# EAGLE design WW-12-fixture (EAGLE 6.5.0)
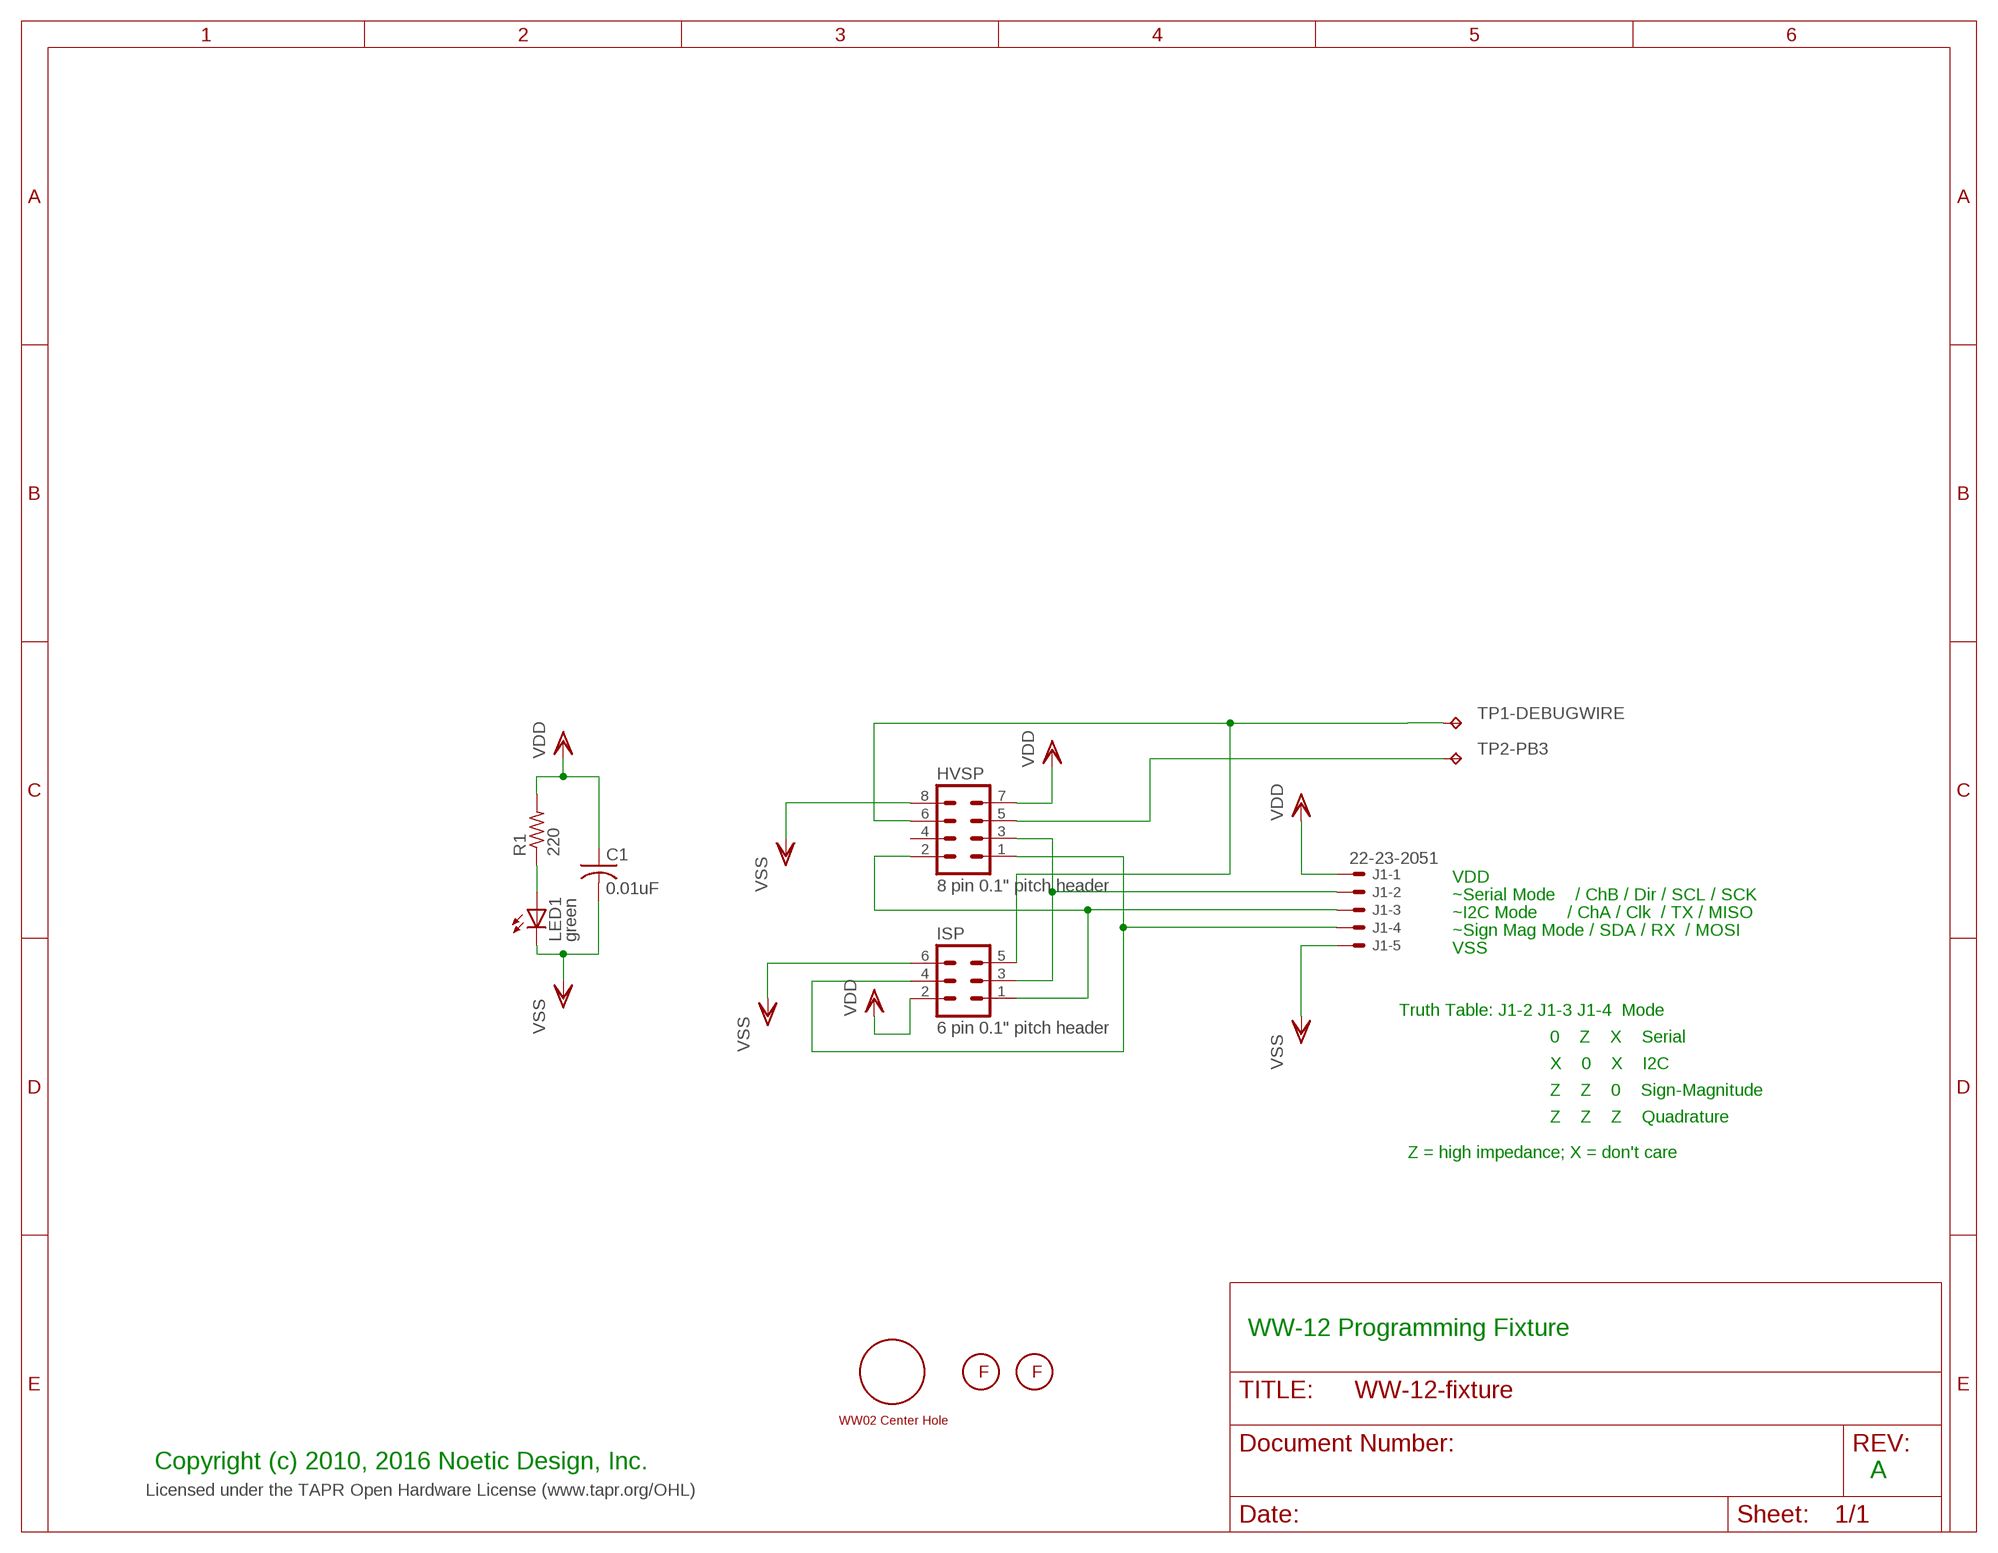
[diagram p0: schematic, sheet 1]

## Parts
C1  0.01uF  C-USC0603  [C0603]
FM1  FIDUCIAL2MMCIRCLE  [FIDUCIAL_2MMCIRCLE]
FM2  FIDUCIAL2MMCIRCLE  [FIDUCIAL_2MMCIRCLE]
HVSP  8 pin 0.1" pitch header  MA04-2  [MA04-2]
ISP  6 pin 0.1" pitch header  MA03-2  [MA03-2]
J1  22-23-2051  [22-23-2051]
LED1  green  LEDCHIP-LED0603  [CHIP-LED0603]
R1  220  R-US_R0603  [R0603]
TP1-DEBUGWIRE  DEBUG WIRE  TPB1,27  [B1,27]
TP2-PB3  DEBUG WIRE  TPB1,27  [B1,27]
U$1  WW02-CENTER  [WW02-CENTER]

## Nets
N$10: LED1.A R1.1
PB0: HVSP.1 ISP.4 J1.4
PB1: HVSP.2 ISP.1 J1.3
PB2: HVSP.3 ISP.3 J1.2
TP1: HVSP.6 ISP.5 TP1-DEBUGWIRE.TP
TP2: HVSP.5 TP2-PB3.TP
VDD: C1.1 HVSP.7 ISP.2 J1.1 R1.2
VSS: C1.2 HVSP.8 ISP.6 J1.5 LED1.C
Unconnected: HVSP.4

## Notes on the sheet
- VDD
- ~Serial Mode    / ChB / Dir / SCL / SCK
- ~I2C Mode      / ChA / Clk  / TX / MISO
- ~Sign Mag Mode / SDA / RX  / MOSI
- VSS
- Truth Table: J1-2 J1-3 J1-4  Mode
- 0    Z    X    Serial
- X    0    X    I2C
- Z    Z    0    Sign-Magnitude
- Z    Z    Z    Quadrature
- Z = high impedance; X = don't care
- WW-12 Programming Fixture
- Copyright (c) 2010, 2016 Noetic Design, Inc.
- A
- Licensed under the TAPR Open Hardware License (www.tapr.org/OHL)

## Library data of the parts
C1 = rcl:C-US: CAPACITOR, American symbol
FM1 FM2 = pickplace:FIDUCIAL: Fiducial marks
HVSP = con-lstb:MA04-2: PIN HEADER
ISP = con-lstb:MA03-2: PIN HEADER
J1 = con-molex:22-23-2051: .100" (2.54mm) Center Header - 5 Pin
LED1 = led:LED: LED OSRAM: - CHIPLED LG R971, LG N971, LY N971, LG Q971, LY Q971, LO R971, LY R971 LH N974, LH R974 LS Q976, LO Q976, LY Q976 LO Q996 - Hyper CHIPLED LW Q18S LB Q993, LB Q99A, LB R99A - SideLED LS A670, LO A670, LY A670, LG A670, LP A670 LB A673, LV A673, LT A673, LW A673 LH A674 LY A675 LS A676, LA A676, LO A676, LY A676, LW A676 LS A679, LY A679, LG A679 - Hyper Micro SIDELED® LS Y876, LA Y876, LO Y876, LY Y876 LT Y87S - SmartLED LW L88C, LW L88S LB L89C, LB L89S, LG L890 LS L89K, LO L89K, LY L89K LS L896, LA L896, LO L896, LY L896 - TOPLED LS T670, LO T670, LY T670, LG T670, LP T670 LSG T670, LSP T670, LSY T670, LOP T670, LYG T670 LG T671, LOG T671, LSG T671 LB T673, LV T673, LT T673, LW T673 LH T674 LS T676, LA T676, LO T676, LY T676, LB T676, LH T676, LSB T676, LW T676 LB T67C, LV T67C, LT T67C, LS T67K, LO T67K, LY T67K, LW E67C LS E67B, LA E67B, LO E67B, LY E67B, LB E67C, LV E67C, LT E67C LW T67C LS T679, LY T679, LG T679 LS T770, LO T770, LY T770, LG T770, LP T770 LB T773, LV T773, LT T773, LW T773 LH T774 LS E675, LA E675, LY E675, LS T675 LS T776, LA T776, LO T776, LY T776, LB T776 LHGB T686 LT T68C, LB T68C - Hyper Mini TOPLED® LB M676 - Mini TOPLED Santana® LG M470 LS M47K, LO M47K, LY M47K Source: http://www.osram.convergy.de LUXEON: - LUMILED® LXK2-PW12-R00, LXK2-PW12-S00, LXK2-PW14-U00, LXK2-PW14-V00 LXK2-PM12-R00, LXK2-PM12-S00, LXK2-PM14-U00 LXK2-PE12-Q00, LXK2-PE12-R00, LXK2-PE12-S00, LXK2-PE14-T00, LXK2-PE14-U00 LXK2-PB12-K00, LXK2-PB12-L00, LXK2-PB12-M00, LXK2-PB14-N00, LXK2-PB14-P00, LXK2-PB14-Q00 LXK2-PR12-L00, LXK2-PR12-M00, LXK2-PR14-Q00, LXK2-PR14-R00 LXK2-PD12-Q00, LXK2-PD12-R00, LXK2-PD12-S00 LXK2-PH12-R00, LXK2-PH12-S00 LXK2-PL12-P00, LXK2-PL12-Q00, LXK2-PL12-R00 Source: www.luxeon.com KINGBRIGHT: KA-3528ASYC Source: www.kingbright.com
R1 = rcl:R-US_: RESISTOR, American symbol
TP1-DEBUGWIRE TP2-PB3 = testpad:TP: Test pad
U$1 = noetic:WW02-CENTER: WW-02/WW-12 center hole

## Net classes
0 default: width 0.203 mm, drill 0.203 mm, clearance 0.229 mm
1 power: width 0.61 mm, drill 0.61 mm, clearance 0.254 mm

## Board
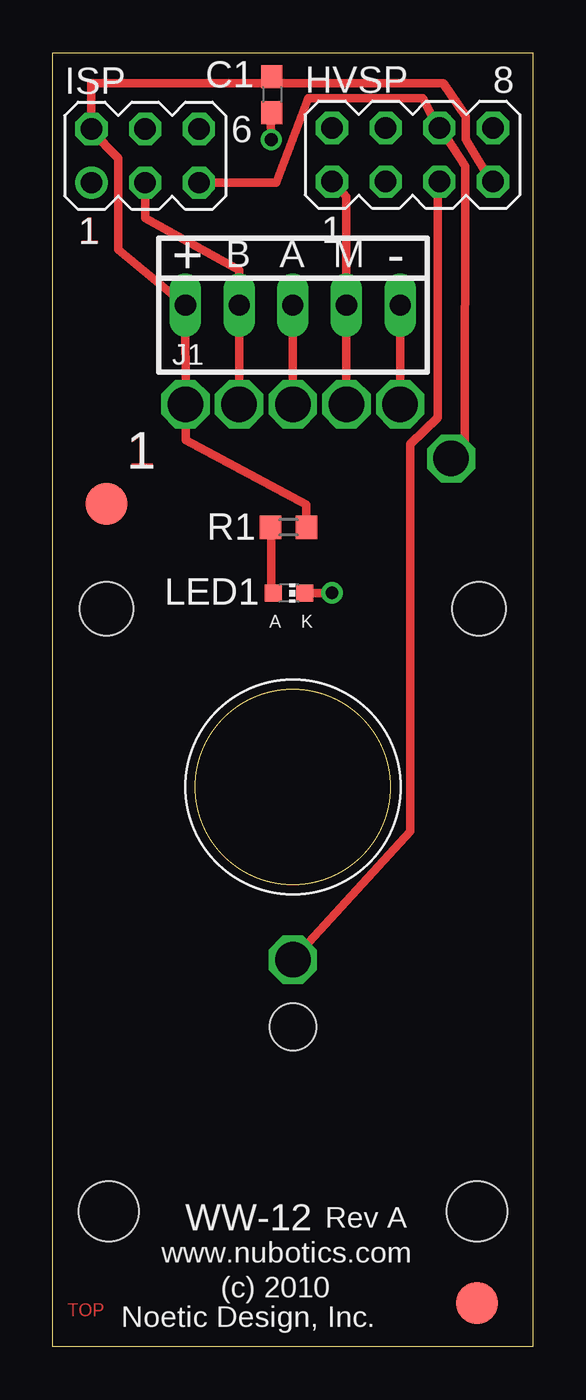
[diagram p1: board, top side]
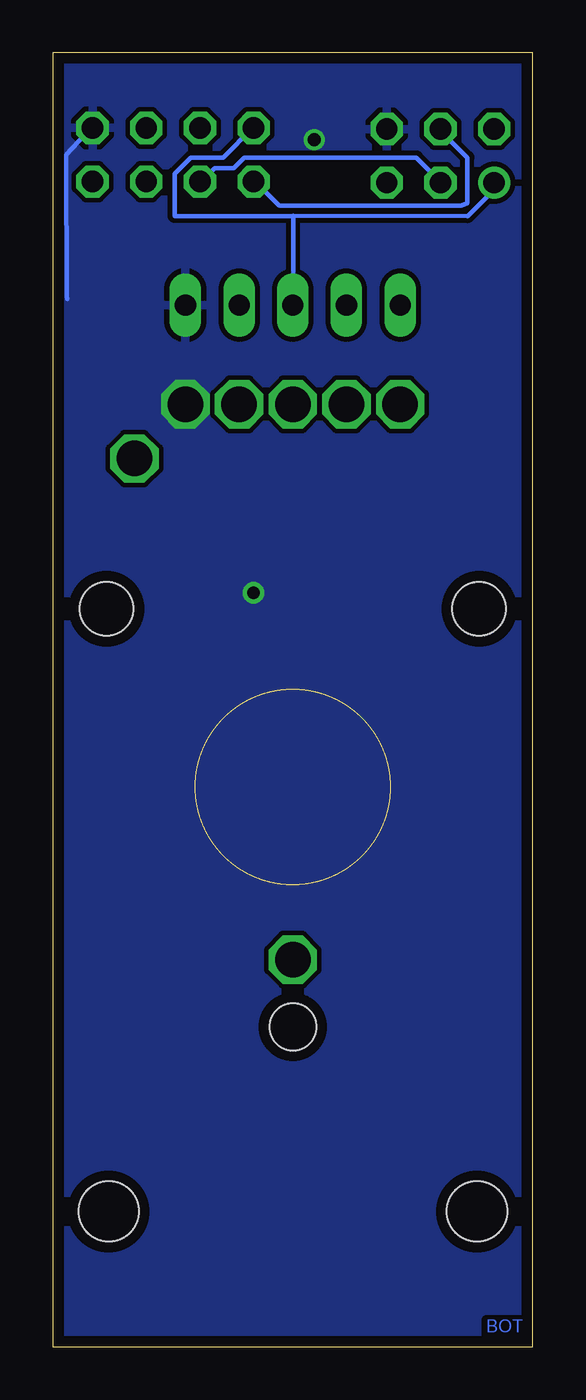
[diagram p2: board, bottom side, seen from below]

Size 22.71 x 61.24 mm. Coordinates in mm from the lower left corner, seen from the top.
Outline: 0,61.24 22.71,61.24 22.71,0 0,0 0,61.24
Copper layers (1*16): Top 0.0178mm / dielectric 59mil / Bottom 0.0178mm
Design rules "SSC-EAGLE-2Lyr_v1.0.0.3 *": minimum track width 6mil, minimum drill 14mil, track to track 6mil, track to pad 6mil, pad to pad 6mil, via to via 6mil, smd to smd 6mil, copper to edge 20mil, drill to drill 16mil, minimum pad ring 8mil, minimum via ring 8mil, stop-mask expansion 3mil, vias tented up to drill 0mil, thermal gap 10mil
Holes 2.54 mm at 2.54,34.92 20.17,34.92
Holes 2.84 mm at 2.64,6.4 20.07,6.4
Holes 2.2 mm at 11.35,15.14
tRestrict: area 0,32.4 to 5.1,37.5; area 17.6,32.4 to 22.7,37.5

### Footprints (pad centres in the part's own frame; a part is rotated, then mirrored left to right if it is on the bottom)
C0603 = smd 1.1 x 1: 1 -0.85,0; 2 0.85,0
FIDUCIAL_2MMCIRCLE = smd 2 x 2: P$1 0,0
MA04-2 = drill 1.016 octagon: 1 -3.81,-1.27; 2 -3.81,1.27; 3 -1.27,-1.27; 4 -1.27,1.27; 5 1.27,-1.27; 6 1.27,1.27; 7 3.81,-1.27; 8 3.81,1.27
MA03-2 = drill 1.016: 1 -2.54,-1.27 | drill 1.016 octagon: 2 -2.54,1.27; 3 0,-1.27; 4 0,1.27; 5 2.54,-1.27; 6 2.54,1.27
22-23-2051 = drill 1 long: 1 -5.08,0; 2 -2.54,0; 3 0,0; 4 2.54,0; 5 5.08,0
CHIP-LED0603 = smd 0.8 x 0.8: A 0,-0.75; C 0,0.75
R0603 = smd 1 x 1.1: 1 -0.85,0; 2 0.85,0
B1,27 = smd 1.27 x 1.27: TP 0,0

### Placement (x,y rotation side)
C1  10.36,59.26 270 top
FM1  20.07,2.06 0 top
FM2  2.54,39.9 0 top
HVSP  17.02,56.41 0 top
ISP  4.37,56.36 0 top
J1  11.35,49.3 0 top
LED1  11.18,35.66 270 top
R1  11.15,38.79 0 top
TP1-DEBUGWIRE  18.85,42.04 180 top
TP2-PB3  11.35,18.31 0 top
U$1  11.35,26.49 0 top

### Tracks (layer width: path | path; a pad name or v marks a point on that pad's centre or on a via)
N$1
  Top 0.406: 16.41,49.3 16.43,49.3 16.43,44.68
N$10
  Top 0.203: LED1.A 10.34,35.71 | 10.34,38.76 R1.1
  Top 0.406: 10.34,35.71 10.34,38.76
PB0  (via drill 1.68)
  Top 0.203: 13.26,55.14 HVSP.1
  Top 0.406: 13.26,55.14 13.89,54.43 13.89,54.13 J1.4 v13.89,44.6
  Bottom 0.203: ISP.4 4.37,57.56 3.1,56.29 3.1,54.13 3.38,54 11.99,54 13.13,55.14 HVSP.1
PB1  (via drill 1.68)
  Top 0.406: v11.35,44.6 J1.3
  Bottom 0.203: J1.3 11.33,50.62 11.34,53.53 | 11.34,53.53 3.1,53.52 3.07,53.52 1.83,54.76 1.83,55.02 ISP.1 | HVSP.2 13.26,57.68 14.66,56.29 16.18,56.29 16.94,55.52 16.94,53.52 11.33,53.52 11.34,53.53
PB2  (via drill 1.68)
  Top 0.203: 4.37,55.02 ISP.3
  Top 0.406: 4.37,55.02 4.37,53.42 8.81,50.95 J1.2 v8.81,44.6
  Bottom 0.203: HVSP.3 15.67,55.14 15.04,55.78 14.15,55.78 13.64,56.29 5.51,56.29 4.37,55.14 ISP.3
TP1  (via drill 1.68)
  Top 0.203: TP1-DEBUGWIRE.TP 18.85,42.06 | 18.34,57.68 HVSP.6 18.21,57.68
  Top 0.406: 18.85,42.06 19.48,42.7 19.51,55.88 18.34,57.68 | 18.21,57.68 17.5,59.08 12.09,59.08 10.57,55.09 ISP.5
  other vias: 18.85,42.04
TP2  (via drill 1.68)
  Top 0.203: 18.21,55.14 HVSP.5
  Top 0.406: TP2-PB3.TP 16.92,24.38 16.92,40.16 16.92,42.72 18.21,43.97 18.21,55.14
  other vias: 11.35,18.31
VDD  (via drill 1.68)
  Top 0.203: 11.99,38.89 R1.2 | 1.83,57.56 ISP.2 1.83,57.68 | 20.75,55.14 HVSP.7
  Top 0.406: 11.99,38.89 11.99,39.85 6.3,42.9 6.29,44.58 | 6.29,44.58 J1.1 3.1,51.92 3.1,56.26 1.83,57.56 | 20.75,55.14 19.56,57.1 19.56,57.12 19.53,57.15 19.53,58.24 18.47,59.79 10.31,59.79 | 10.31,59.79 1.83,59.79 1.83,57.68 | 10.31,59.79 C1.1 | v6.27,44.6 6.29,44.6 6.29,44.58
VSS  (via drill 0.6, 1.68)
  Top 0.203: ISP.6 6.91,57.56
  Top 0.406: LED1.C 12.95,35.66 v13.21,35.69 | C1.2 10.31,58.15 v10.34,57.12
  Bottom 0.203: HVSP.8 20.88,57.68 22.07,56.41 22.05,49.71 22.03,49.58
  other vias: 16.43,44.6
  pour Bottom: 22.4,0.28 22.17,60.91 0.33,60.96 0.3,0.28

### Text on the board
Top: 1 | 1 | TOP
Bottom: BOT
tPlace: 1 | A | K | WW-12 | Rev A | www.nubotics.com | (c) 2010 | Noetic Design, Inc.
tNames: + | B | A | M | -
Document: Licensed under the TAPR Open Hardware License (www.tapr.org/OHL)
bDocu: Programming Fixture